# Altium schematic sheet toy.SchDoc
size A4
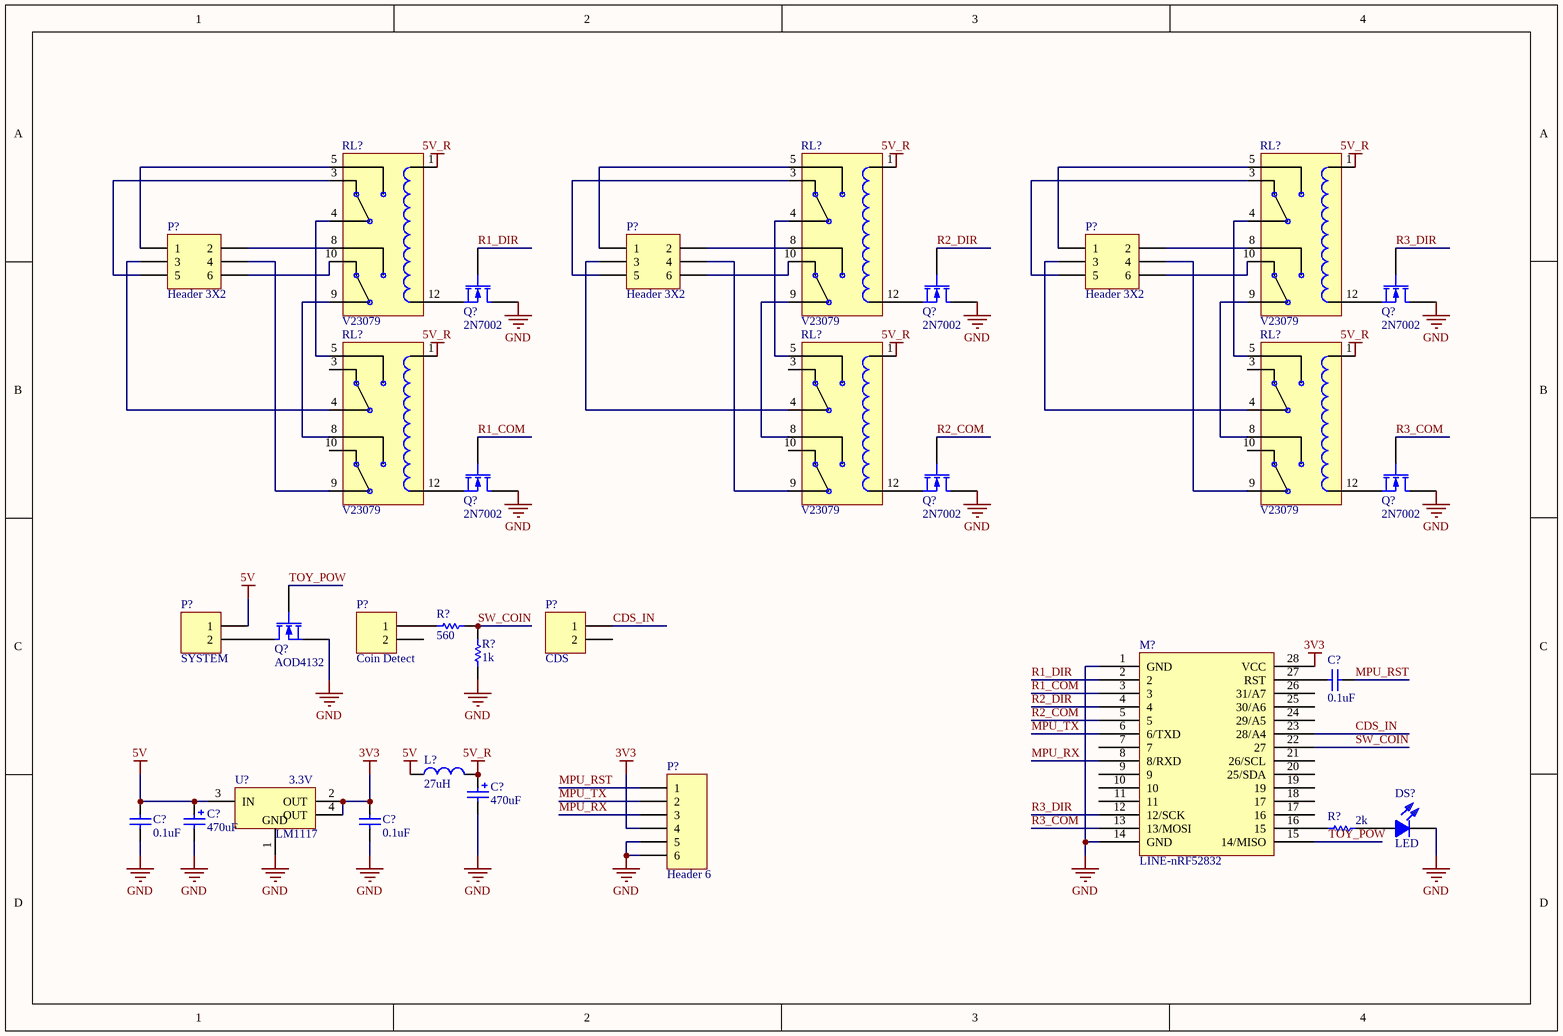
[diagram p0: toy.SchDoc]

## Parts
(Parts that share a designator on the sheet are numbered #1, #2 ... from top to bottom, then left to right.)
C?#1  value 0.1uF  [Land2.54-2]  (hidden comment: Cap1)
C?#2  value 470uF  [CE04-5]  (hidden comment: Cap2)
C?#3  value 470uF  [CE04-5]  (hidden comment: Cap2)
C?#4  value 0.1uF  [Land2.54-2]  (hidden comment: Cap1)
C?#5  value 0.1uF  [Land2.54-2]  (hidden comment: Cap1)
DS?  LED  [RoundTypeLED-3]
L?  value 27uH  [Axial1]  (hidden comment: Inductor)
M?  LINE-nRF52832
P?#1  Header 3X2  [HDR2X3]
P?#2  Header 3X2  [HDR2X3]
P?#3  Header 3X2  [HDR2X3]
P?#4  SYSTEM  [HDR1X2]
P?#5  Coin Detect  [HDR1X2]
P?#6  CDS  [HDR1X2]
P?#7  Header 6  [HDR1X6]
Q?#1  2N7002  [SOT23-3]
Q?#2  2N7002  [SOT23-3]
Q?#3  2N7002  [SOT23-3]
Q?#4  2N7002  [SOT23-3]
Q?#5  2N7002  [SOT23-3]
Q?#6  2N7002  [SOT23-3]
Q?#7  AOD4132  [TO-252AA]
R?#1  value 560  [Axial1]  (hidden comment: Res)
R?#2  value 1k  [Axial1]  (hidden comment: Res)
R?#3  value 2k  [Axial1]  (hidden comment: Res)
RL?#1  V23079
RL?#2  V23079
RL?#3  V23079
RL?#4  V23079
RL?#5  V23079
RL?#6  V23079
U?  LM1117  value 3.3V  [SOT223-4L]

## Nets
3V3: C?#5.2 M?.28(VCC) P?#7.4 U?.2(OUT) U?.4(OUT)
5V: C?#3.1 C?#4.2 L?.1 P?#4.1 U?.3(IN)
5V_R: C?#2.1 L?.2 RL?#1.1 RL?#2.1 RL?#3.1 RL?#4.1 RL?#5.1 RL?#6.1
GND: C?#2.2 C?#3.2 C?#4.1 C?#5.1 DS?.2 M?.1(GND) M?.14(GND) P?#7.5 P?#7.6 Q?#1.3(D) Q?#2.3(D) Q?#3.3(D) Q?#4.3(D) Q?#5.3(D) Q?#6.3(D) Q?#7.3(S) R?#2.1 U?.1(GND)
CDS_IN: M?.23(28/A4) P?#6.1
MPU_RST: C?#1.1 P?#7.1
MPU_RX: M?.8(8/RXD) P?#7.3
MPU_TX: M?.6(6/TXD) P?#7.2
R1_COM: M?.3 Q?#4.1(G)
R1_DIR: M?.2 Q?#1.1(G)
R2_COM: M?.5 Q?#5.1(G)
R2_DIR: M?.4 Q?#2.1(G)
R3_COM: M?.13(13/MOSI) Q?#6.1(G)
R3_DIR: M?.12(12/SCK) Q?#3.1(G)
SW_COIN: M?.22(27) R?#1.2 R?#2.2
TOY_POW: M?.15(14/MISO) Q?#7.1(G)
NetC?#1_2: C?#1.2 M?.27(RST)
NetDS?_1: DS?.1 R?#3.2
NetM?_16: M?.16(15) R?#3.1
NetP?#1_1: P?#1.1 RL?#1.5
NetP?#1_2: P?#1.2 RL?#1.8
NetP?#1_3: P?#1.3 RL?#4.4
NetP?#1_4: P?#1.4 RL?#4.9
NetP?#1_5: P?#1.5 RL?#1.3
NetP?#1_6: P?#1.6 RL?#1.10
NetP?#2_1: P?#2.1 RL?#2.5
NetP?#2_2: P?#2.2 RL?#2.8
NetP?#2_3: P?#2.3 RL?#5.4
NetP?#2_4: P?#2.4 RL?#5.9
NetP?#2_5: P?#2.5 RL?#2.3
NetP?#2_6: P?#2.6 RL?#2.10
NetP?#3_1: P?#3.1 RL?#3.5
NetP?#3_2: P?#3.2 RL?#3.8
NetP?#3_3: P?#3.3 RL?#6.4
NetP?#3_4: P?#3.4 RL?#6.9
NetP?#3_5: P?#3.5 RL?#3.3
NetP?#3_6: P?#3.6 RL?#3.10
NetP?#4_2: P?#4.2 Q?#7.4(D)
NetP?#5_1: P?#5.1 R?#1.1
NetQ?#1_2: Q?#1.2(S) RL?#1.12
NetQ?#2_2: Q?#2.2(S) RL?#2.12
NetQ?#3_2: Q?#3.2(S) RL?#3.12
NetQ?#4_2: Q?#4.2(S) RL?#4.12
NetQ?#5_2: Q?#5.2(S) RL?#5.12
NetQ?#6_2: Q?#6.2(S) RL?#6.12
NetRL?#1_4: RL?#1.4 RL?#4.5
NetRL?#1_9: RL?#1.9 RL?#4.8
NetRL?#2_4: RL?#2.4 RL?#5.5
NetRL?#2_9: RL?#2.9 RL?#5.8
NetRL?#3_4: RL?#3.4 RL?#6.5
NetRL?#3_9: RL?#3.9 RL?#6.8

Not connected (* = marked no-connect by the designer): M? 7 9 10 11 17(16) 18(17) 19 20(25/SDA) 21(26/SCL) 24(29/A5) 25(30/A6) 26(31/A7); P?#5 2; P?#6 2; RL?#4 3 10; RL?#5 3 10; RL?#6 3 10

## Library data of the parts
DS? = LED: color: red
P?#1-P?#3 = Header 3X2: Header, 3-Pin, Dual row; LatestRevisionDate: 17-Jul-2002; LatestRevisionNote: Re-released for DXP Platform.; Publisher: Altium Limited
P?#4-P?#6 = Header 2: Header, 2-Pin; LatestRevisionDate: 17-Jul-2002; LatestRevisionNote: Re-released for DXP Platform.; Publisher: Altium Limited
P?#7 = Header 6: Header, 6-Pin; LatestRevisionDate: 17-Jul-2002; LatestRevisionNote: Re-released for DXP Platform.; Publisher: Altium Limited
Q?#1-Q?#6 = 2N7002: N-Channel MOSFET